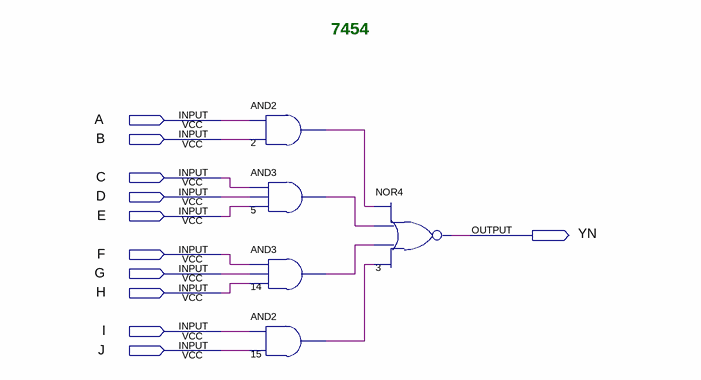
[diagram p0: schematic sheet]
// Quartus schematic 7454.bdf as structural Verilog: 5 symbols, 11 pins
module \7454  (
  input  A,
  input  B,
  input  C,
  input  D,
  input  E,
  input  F,
  input  G,
  input  H,
  input  I,
  input  J,
  output YN
);

  wire n2_out, n5_out, n14_out, n15_out;

  and u_2 (n2_out, A, B);
  and u_5 (n5_out, C, D, E);
  and u_14 (n14_out, F, G, H);
  and u_15 (n15_out, I, J);
  nor u_3 (YN, n2_out, n5_out, n14_out, n15_out);

  // Notes on the sheet:
  //   7454
endmodule
